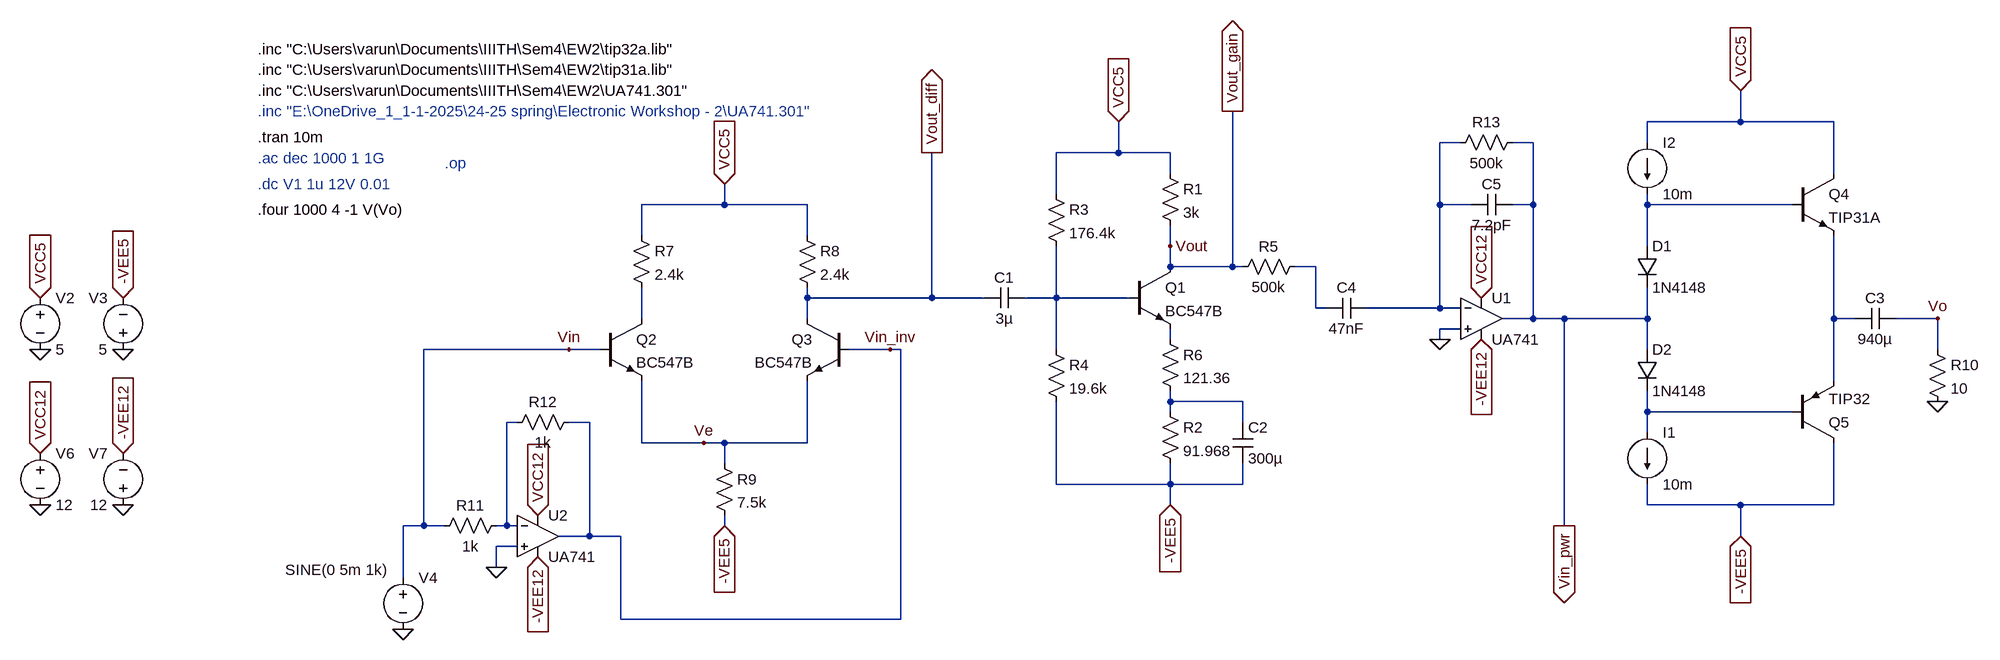
[diagram p0: schematic AudioAmp2.asc]
AudioAmp2.asc, the LTspice schematic file:
Version 4
SHEET 1 3268 888
WIRE 2304 -128 2304 -176
WIRE 2304 -128 2160 -128
WIRE 2448 -128 2304 -128
WIRE 1872 -96 1840 -96
WIRE 1984 -96 1952 -96
WIRE 2160 -96 2160 -128
WIRE 1344 -80 1344 -128
WIRE 1344 -80 1248 -80
WIRE 1424 -80 1344 -80
WIRE 1424 -48 1424 -80
WIRE 2448 -48 2448 -128
WIRE 1248 -16 1248 -80
WIRE 736 0 736 -32
WIRE 736 0 608 0
WIRE 864 0 736 0
WIRE 1840 0 1840 -96
WIRE 1888 0 1840 0
WIRE 1984 0 1984 -96
WIRE 1984 0 1952 0
WIRE 2160 0 2160 -16
WIRE 2384 0 2160 0
WIRE 608 48 608 0
WIRE 864 48 864 0
WIRE 1424 64 1424 32
WIRE 2160 64 2160 0
WIRE 1424 96 1424 64
WIRE 1520 96 1520 -144
WIRE 1520 96 1424 96
WIRE 1536 96 1520 96
WIRE 1648 96 1616 96
WIRE 864 144 864 128
WIRE 1056 144 1056 -80
WIRE 1056 144 864 144
WIRE 1136 144 1056 144
WIRE 1248 144 1248 64
WIRE 1248 144 1200 144
WIRE 1360 144 1248 144
WIRE 1648 160 1648 96
WIRE 1664 160 1648 160
WIRE 1840 160 1840 0
WIRE 1840 160 1728 160
WIRE 1872 160 1840 160
WIRE 608 176 608 128
WIRE 864 176 864 144
WIRE 1984 176 1984 0
WIRE 1984 176 1936 176
WIRE 2032 176 1984 176
WIRE 2160 176 2160 128
WIRE 2160 176 2032 176
WIRE 2448 176 2448 48
WIRE 2480 176 2448 176
WIRE 2608 176 2544 176
WIRE 1872 192 1840 192
WIRE 1424 208 1424 192
WIRE 1840 208 1840 192
WIRE 496 224 272 224
WIRE 544 224 496 224
WIRE 992 224 928 224
WIRE 1008 224 992 224
WIRE 1248 224 1248 144
WIRE 2160 224 2160 176
WIRE 2608 224 2608 176
WIRE 2448 272 2448 176
WIRE 1424 304 1424 288
WIRE 1536 304 1424 304
WIRE 1424 320 1424 304
WIRE 2160 320 2160 288
WIRE 2384 320 2160 320
WIRE 416 336 400 336
WIRE 528 336 496 336
WIRE 1536 336 1536 304
WIRE 2160 352 2160 320
WIRE 608 368 608 272
WIRE 704 368 608 368
WIRE 736 368 704 368
WIRE 864 368 864 272
WIRE 864 368 736 368
WIRE 736 400 736 368
WIRE 1248 432 1248 304
WIRE 1424 432 1424 400
WIRE 1424 432 1248 432
WIRE 1536 432 1536 400
WIRE 1536 432 1424 432
WIRE 1424 464 1424 432
WIRE 2160 464 2160 432
WIRE 2304 464 2160 464
WIRE 2448 464 2448 368
WIRE 2448 464 2304 464
WIRE 272 496 272 224
WIRE 272 496 240 496
WIRE 304 496 272 496
WIRE 400 496 400 336
WIRE 400 496 384 496
WIRE 416 496 400 496
WIRE 736 496 736 480
WIRE 2032 496 2032 176
WIRE 528 512 528 336
WIRE 528 512 480 512
WIRE 576 512 528 512
WIRE 2304 512 2304 464
WIRE 416 528 384 528
WIRE 384 560 384 528
WIRE 240 576 240 496
WIRE 576 640 576 512
WIRE 1008 640 1008 224
WIRE 1008 640 576 640
FLAG 1424 64 Vout
FLAG 496 224 Vin
FLAG 992 224 Vin_inv
FLAG 704 368 Ve
FLAG -192 224 0
FLAG -320 224 0
FLAG -320 144 VCC5
IOPIN -320 144 In
FLAG -192 144 -VEE5
IOPIN -192 144 In
FLAG 736 496 -VEE5
IOPIN 736 496 In
FLAG 736 -32 VCC5
IOPIN 736 -32 In
FLAG -320 384 VCC12
IOPIN -320 384 In
FLAG -192 464 0
FLAG -320 464 0
FLAG -192 384 -VEE12
IOPIN -192 384 In
FLAG 1904 144 VCC12
IOPIN 1904 144 In
FLAG 1904 208 -VEE12
IOPIN 1904 208 In
FLAG 1840 208 0
FLAG 2032 496 Vin_pwr
IOPIN 2032 496 Out
FLAG 1344 -128 VCC5
IOPIN 1344 -128 In
FLAG 1424 464 -VEE5
IOPIN 1424 464 In
FLAG 1056 -80 Vout_diff
IOPIN 1056 -80 Out
FLAG 1520 -144 Vout_gain
IOPIN 1520 -144 Out
FLAG 2608 304 0
FLAG 2608 176 Vo
FLAG 2304 -176 VCC5
IOPIN 2304 -176 In
FLAG 2304 512 -VEE5
IOPIN 2304 512 In
FLAG 384 560 0
FLAG 448 544 -VEE12
IOPIN 448 544 In
FLAG 448 480 VCC12
IOPIN 448 480 In
FLAG 240 656 0
SYMBOL npn 1360 96 R0
SYMATTR InstName Q1
SYMATTR Value BC547B
SYMBOL res 1408 -64 R0
SYMATTR InstName R1
SYMATTR Value 3k
SYMBOL res 1408 304 R0
SYMATTR InstName R2
SYMATTR Value 91.968
SYMBOL res 1232 -32 R0
SYMATTR InstName R3
SYMATTR Value 176.4k
SYMBOL res 1232 208 R0
SYMATTR InstName R4
SYMATTR Value 19.6k
SYMBOL cap 1200 128 R90
WINDOW 0 0 32 VBottom 2
WINDOW 3 32 32 VTop 2
SYMATTR InstName C1
SYMATTR Value 3µ
SYMBOL res 1408 192 R0
SYMATTR InstName R6
SYMATTR Value 121.36
SYMBOL cap 1520 336 R0
SYMATTR InstName C2
SYMATTR Value 300µ
SYMBOL res 592 32 R0
SYMATTR InstName R7
SYMATTR Value 2.4k
SYMBOL res 848 32 R0
SYMATTR InstName R8
SYMATTR Value 2.4k
SYMBOL npn 544 176 R0
SYMATTR InstName Q2
SYMATTR Value BC547B
SYMBOL npn 928 176 M0
SYMATTR InstName Q3
SYMATTR Value BC547B
SYMBOL res 720 384 R0
SYMATTR InstName R9
SYMATTR Value 7.5k
SYMBOL voltage -320 128 R0
SYMATTR InstName V2
SYMATTR Value 5
SYMBOL voltage -192 240 R180
WINDOW 0 24 96 Left 2
WINDOW 3 24 16 Left 2
SYMATTR InstName V3
SYMATTR Value 5
SYMBOL voltage 240 560 R0
WINDOW 123 24 44 Left 2
WINDOW 39 0 0 Left 0
WINDOW 3 -182 4 Left 2
SYMATTR Value SINE(0 5m 1k)
SYMATTR InstName V4
SYMBOL OpAmps\\opamp2 1904 112 R0
SYMATTR InstName U1
SYMATTR Value UA741
SYMBOL voltage -320 368 R0
SYMATTR InstName V6
SYMATTR Value 12
SYMBOL voltage -192 480 R180
WINDOW 0 24 96 Left 2
WINDOW 3 24 16 Left 2
SYMATTR InstName V7
SYMATTR Value 12
SYMBOL cap 1952 -16 R90
WINDOW 0 0 32 VBottom 2
WINDOW 3 32 32 VTop 2
SYMATTR InstName C5
SYMATTR Value 7.2pF
SYMBOL res 1632 80 R90
WINDOW 0 0 56 VBottom 2
WINDOW 3 32 56 VTop 2
SYMATTR InstName R5
SYMATTR Value 500k
SYMBOL cap 1728 144 R90
WINDOW 0 0 32 VBottom 2
WINDOW 3 32 32 VTop 2
SYMATTR InstName C4
SYMATTR Value 47nF
SYMBOL res 1968 -112 R90
WINDOW 0 0 56 VBottom 2
WINDOW 3 32 56 VTop 2
SYMATTR InstName R13
SYMATTR Value 500k
SYMBOL diode 2144 64 R0
SYMATTR InstName D1
SYMATTR Value 1N4148
SYMBOL diode 2144 224 R0
SYMATTR InstName D2
SYMATTR Value 1N4148
SYMBOL npn 2384 -48 R0
SYMATTR InstName Q4
SYMATTR Value TIP31A
SYMBOL pnp 2384 368 M180
SYMATTR InstName Q5
SYMATTR Value TIP32
SYMBOL res 2592 208 R0
SYMATTR InstName R10
SYMATTR Value 10
SYMBOL cap 2544 160 R90
WINDOW 0 0 32 VBottom 2
WINDOW 3 32 32 VTop 2
SYMATTR InstName C3
SYMATTR Value 940µ
SYMBOL current 2160 352 R0
SYMATTR InstName I1
SYMATTR Value 10m
SYMBOL current 2160 -96 R0
SYMATTR InstName I2
SYMATTR Value 10m
SYMBOL OpAmps\\opamp2 448 448 R0
SYMATTR InstName U2
SYMATTR Value UA741
SYMBOL res 400 480 R90
WINDOW 0 0 56 VBottom 2
WINDOW 3 32 56 VTop 2
SYMATTR InstName R11
SYMATTR Value 1k
SYMBOL res 512 320 R90
WINDOW 0 0 56 VBottom 2
WINDOW 3 32 56 VTop 2
SYMATTR InstName R12
SYMATTR Value 1k
TEXT 16 -32 Left 2 ;.dc V1 1u 12V 0.01
TEXT 16 8 Left 2 !.four 1000 4 -1 V(Vo)
TEXT 304 -64 Left 2 ;.op
TEXT 16 -104 Left 2 !.tran 10m
TEXT 16 -72 Left 2 ;.ac dec 1000 1 1G
TEXT 16 -144 Left 2 ;.inc "E:\\OneDrive_1_1-1-2025\\24-25 spring\\Electronic Workshop - 2\\UA741.301"
TEXT 16 -176 Left 2 !.inc "C:\\Users\\varun\\Documents\\IIITH\\Sem4\\EW2\\UA741.301"
TEXT 16 -208 Left 2 !.inc "C:\\Users\\varun\\Documents\\IIITH\\Sem4\\EW2\\tip31a.lib"
TEXT 16 -240 Left 2 !.inc "C:\\Users\\varun\\Documents\\IIITH\\Sem4\\EW2\\tip32a.lib"

The netlist it stands for:
* AudioAmp2.asc
Q1 Vout_gain N004 N007 0 BC547B
R1 VCC5 Vout_gain 3k
R2 N008 -VEE5 91.968
R3 VCC5 N004 176.4k
R4 N004 -VEE5 19.6k
C1 N004 Vout_diff 3µ
R6 N007 N008 121.36
C2 N008 -VEE5 300µ
R7 VCC5 N005 2.4k
R8 VCC5 Vout_diff 2.4k
Q2 N005 Vin Ve 0 BC547B
Q3 Vout_diff Vin_inv Ve 0 BC547B
R9 Ve -VEE5 7.5k
V2 VCC5 0 5
V3 0 -VEE5 5
V4 Vin 0 SINE(0 5m 1k)
XU1 0 N001 VCC12 -VEE12 Vin_pwr UA741  ; pins In+ In- V+ V- OUT
V6 VCC12 0 12
V7 0 -VEE12 12
C5 Vin_pwr N001 7.2pF
R5 N003 Vout_gain 500k
C4 N001 N003 47nF
R13 Vin_pwr N001 500k
D1 N002 Vin_pwr 1N4148
D2 Vin_pwr N009 1N4148
Q4 VCC5 N002 N006 0 TIP31A
Q5 -VEE5 N009 N006 0 TIP32
R10 Vo 0 10
C3 Vo N006 940µ
I1 N009 -VEE5 10m
I2 VCC5 N002 10m
XU2 0 N010 VCC12 -VEE12 Vin_inv UA741  ; pins In+ In- V+ V- OUT
R11 N010 Vin 1k
R12 Vin_inv N010 1k
.model D D
.lib standard.dio
.model NPN NPN
.model PNP PNP
.lib standard.bjt
* .dc V1 1u 12V 0.01
.four 1000 4 -1 V(Vo)
* .op
.tran 10m
* .ac dec 1000 1 1G
* .inc "E:\OneDrive_1_1-1-2025\24-25 spring\Electronic Workshop - 2\UA741.301"
.inc "C:\Users\varun\Documents\IIITH\Sem4\EW2\UA741.301"
.inc "C:\Users\varun\Documents\IIITH\Sem4\EW2\tip31a.lib"
.inc "C:\Users\varun\Documents\IIITH\Sem4\EW2\tip32a.lib"
.backanno
.end